# Altium schematic sheet Humidifier.SchDoc
size A2; PageSetup: Record=PageOptions|CenterHorizontal=True|CenterVertical=True|PrintScale=1.00|XCorrection=1.00|YCorrection=1.00|PrintKind=0|BorderSize=5000000|LeftOffset=0|BottomOffset=0|Orientation=2|PaperLength=1000|PaperWidth=1000|Scale=100|PaperSource=7|PrintQuality=-4|MediaType=1|DitherType=10|PaperKind=A4|PrintScaleMode=1
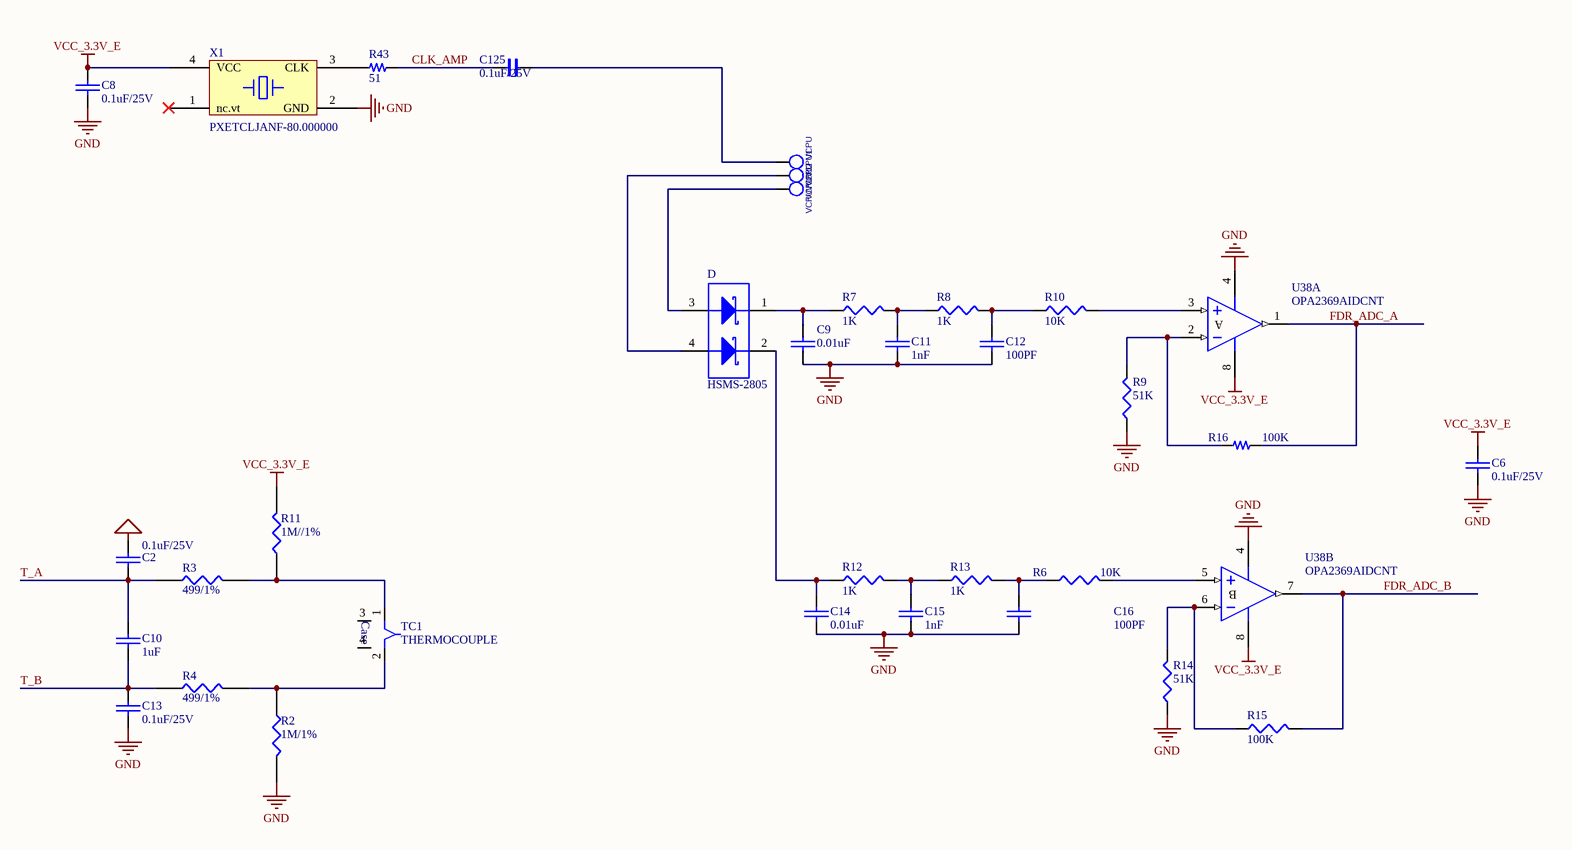
[diagram p0: Humidifier.SchDoc]

## Parts
C2  0.1uF/25V  [0603c]
C6  0.1uF/25V  [0603C]
C8  0.1uF/25V  [0603C]
C9  0.01uF  [0603C]
C10  1uF  [0603c]
C11  1nF  [0603C]
C12  100PF  [0603C]
C13  0.1uF/25V  [0603c]
C14  0.01uF  [0603C]
C15  1nF  [0603C]
C16  100PF  [0603C]
C125  0.1uF/25V  [0603C]
D  HSMS-2805  [HSMS-2805]
R2  1M/1%  [0603r]
R3  499/1%  [0603r]
R4  499/1%  [0603r]
R6  10K  [0603R]
R7  1K  [0603R]
R8  1K  [0603R]
R9  51K  [0603R]
R10  10K  [0603R]
R11  1M//1%  [0603r]
R12  1K  [0603R]
R13  1K  [0603R]
R14  51K  [0603R]
R15  100K  [0603R]
R16  100K  [0603R]
R43  51  [0603r]
TC1  THERMOCOUPLE  [0603R]
U38  OPA2369AIDCNT  [OPA2369AIDCNT]  (parts A,B of 2)
VCPU  VCPU  [probe]
VCPU1  VCPU  [probe]
VCPU2  VCPU  [probe]
X1  PXETCLJANF-80.000000  [XTAL4TN_7050]

## Nets
GND: C2.2 C6.1 C8.2 C9.2 C11.2 C12.2 C13.2 C14.2 C15.2 C16.2 R2.2 R9.1 R14.1 U38.4(V-) X1.2(GND)
VCC_3.3V_E: C6.2 C8.1 R11.2 U38.8(V+) X1.4(VCC)
CLK_AMP: C125.1 R43.2
FDR_ADC_A: R16.2 U38.1(OUT)
FDR_ADC_B: R15.2 U38.7(OUT)
T_A: C2.1 C10.1 R3.1
T_B: C10.2 C13.1 R4.1
NetC9_1: C9.1 D.1(K) R7.1
NetC11_1: C11.1 R7.2 R8.1
NetC12_1: C12.1 R8.2 R10.1
NetC14_1: C14.1 D.2(K) R12.1
NetC15_1: C15.1 R12.2 R13.1
NetC16_1: C16.1 R6.1 R13.2
NetC125_2: C125.2 VCPU.1(TP)
NetD_3: D.3(A) VCPU2.1(TP)
NetD_4: D.4(A) VCPU1.1(TP)
NetR2_1: R2.1 R4.2 TC1.2
NetR3_2: R3.2 R11.1 TC1.1
NetR6_2: R6.2 U38.5(IN+)
NetR9_2: R9.2 R16.1 U38.2(IN-)
NetR10_2: R10.2 U38.3(IN+)
NetR14_2: R14.2 R15.1 U38.6(IN-)
NetR43_1: R43.1 X1.3(CLK)

Not connected (* = marked no-connect by the designer): TC1 3 4; X1 1(nc.vt)*

## Notes on the sheet
- (in symbol LM2904D, part A) A
- (in symbol LM2904D, part B) B
- (in symbol THERMOCOUPLE) Case

## Library data of the parts
C2 C6 C8-C16 = CAP: Capacitor
C125 = C
R2-R4 R11 = RES1
R6-R10 R12-R15 = Res3: Resistor; Published: 8-Jun-2000; LatestRevisionDate: 29-May-2009; LatestRevisionNote: IPC-7351 Footprint Added.; PackageReference: J1-0603; Publisher: Altium Limited; PackageDescription: Chip Resistor
R16 R43 = R
U38 = LM2904D: Dual Operational Amplifier; Published: 16-Jan-2001; LatestRevisionDate: 13-Apr-2006; LatestRevisionNote: IPC-7351 Footprint Added.; DatasheetVersion: Jul-1998; PackageVersion: Jan-1998; PackageReference: D008; Publisher: Altium Limited; PackageDescription: 8-Pin Small Outline Integrated Circuit 1.27 mm Pitch; Code_IPC: SOIC127P600-8; ComponentLink1Description: Manufacturer Link; ComponentLink1URL: http://www.ti.com/; ComponentLink2Description: Datasheet; ComponentLink2URL: http://www-s.ti.com/sc/ds/lm2904.pdf
VCPU VCPU1 VCPU2 = T_POINT_R
X1 = XTAL4S